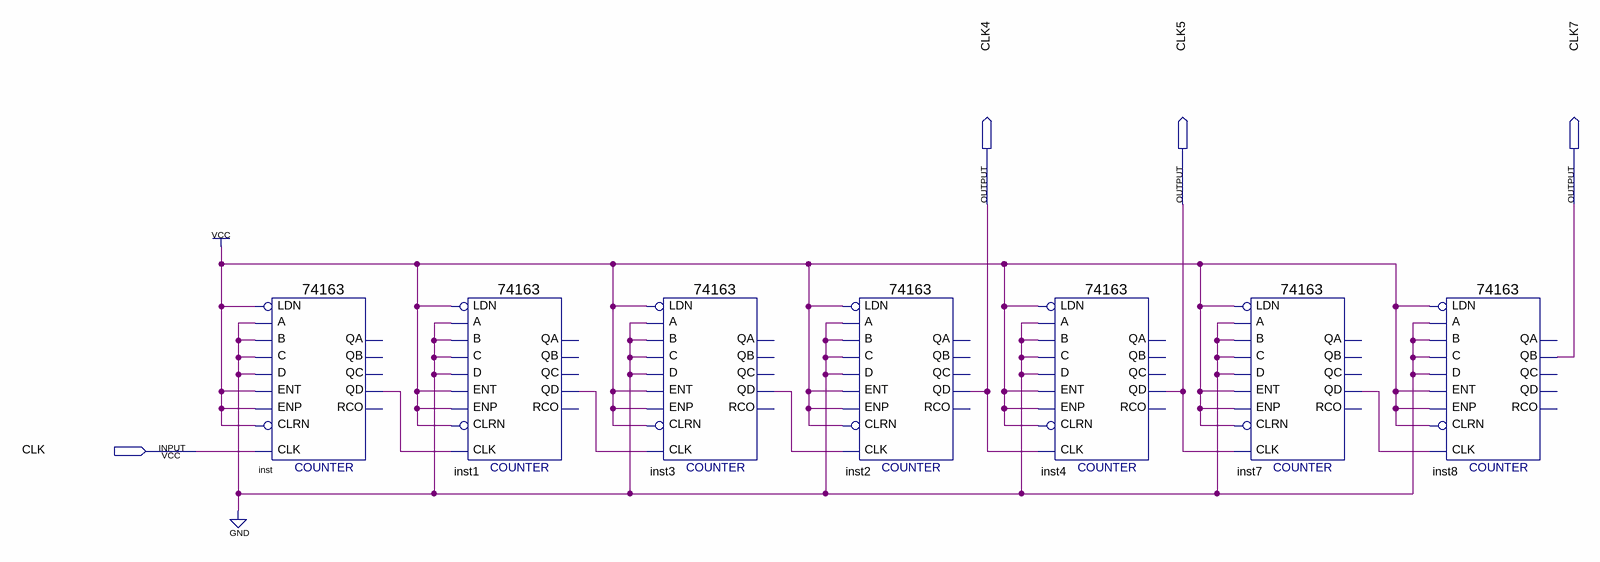
[diagram p0: schematic sheet]
// Quartus schematic clock.bdf as structural Verilog: 7 symbols, 4 pins
module clock (
  input  CLK,
  output CLK4,
  output CLK5,
  output CLK7
);

  wire inst1_qd, inst3_qd, inst7_qd, inst_qd;

  \74163  inst (
    .C(1'b0), .B(1'b0), .A(1'b0), .ENT(1'b1), .D(1'b0), .CLRN(1'b1), .CLK(CLK), .ENP(1'b1), .LDN(1'b1),
    .QD(inst_qd));  // open: QA, QB, QC, RCO
  \74163  inst1 (
    .C(1'b0), .B(1'b0), .A(1'b0), .ENT(1'b1), .D(1'b0), .CLRN(1'b1), .CLK(inst_qd), .ENP(1'b1), .LDN(1'b1),
    .QD(inst1_qd));  // open: QA, QB, QC, RCO
  \74163  inst3 (
    .C(1'b0), .B(1'b0), .A(1'b0), .ENT(1'b1), .D(1'b0), .CLRN(1'b1), .CLK(inst1_qd), .ENP(1'b1), .LDN(1'b1),
    .QD(inst3_qd));  // open: QA, QB, QC, RCO
  \74163  inst2 (
    .C(1'b0), .B(1'b0), .A(1'b0), .ENT(1'b1), .D(1'b0), .CLRN(1'b1), .CLK(inst3_qd), .ENP(1'b1), .LDN(1'b1),
    .QD(CLK4));  // open: QA, QB, QC, RCO
  \74163  inst4 (
    .C(1'b0), .B(1'b0), .A(1'b0), .ENT(1'b1), .D(1'b0), .CLRN(1'b1), .CLK(CLK4), .ENP(1'b1), .LDN(1'b1),
    .QD(CLK5));  // open: QA, QB, QC, RCO
  \74163  inst7 (
    .C(1'b0), .B(1'b0), .A(1'b0), .ENT(1'b1), .D(1'b0), .CLRN(1'b1), .CLK(CLK5), .ENP(1'b1), .LDN(1'b1),
    .QD(inst7_qd));  // open: QA, QB, QC, RCO
  \74163  inst8 (
    .C(1'b0), .B(1'b0), .A(1'b0), .ENT(1'b1), .D(1'b0), .CLRN(1'b1), .CLK(inst7_qd), .ENP(1'b1), .LDN(1'b1),
    .QB(CLK7));  // open: QA, QC, QD, RCO
endmodule
